# Altium schematic sheet S7CAS-PLEIADES-CARTE-MERE_P07_MOT.SchDoc
size Tabloid; DocumentNumber: 13; SheetNumber: 13; SheetTotal: 16; Sheet_Name: MOT; Size: 11x17
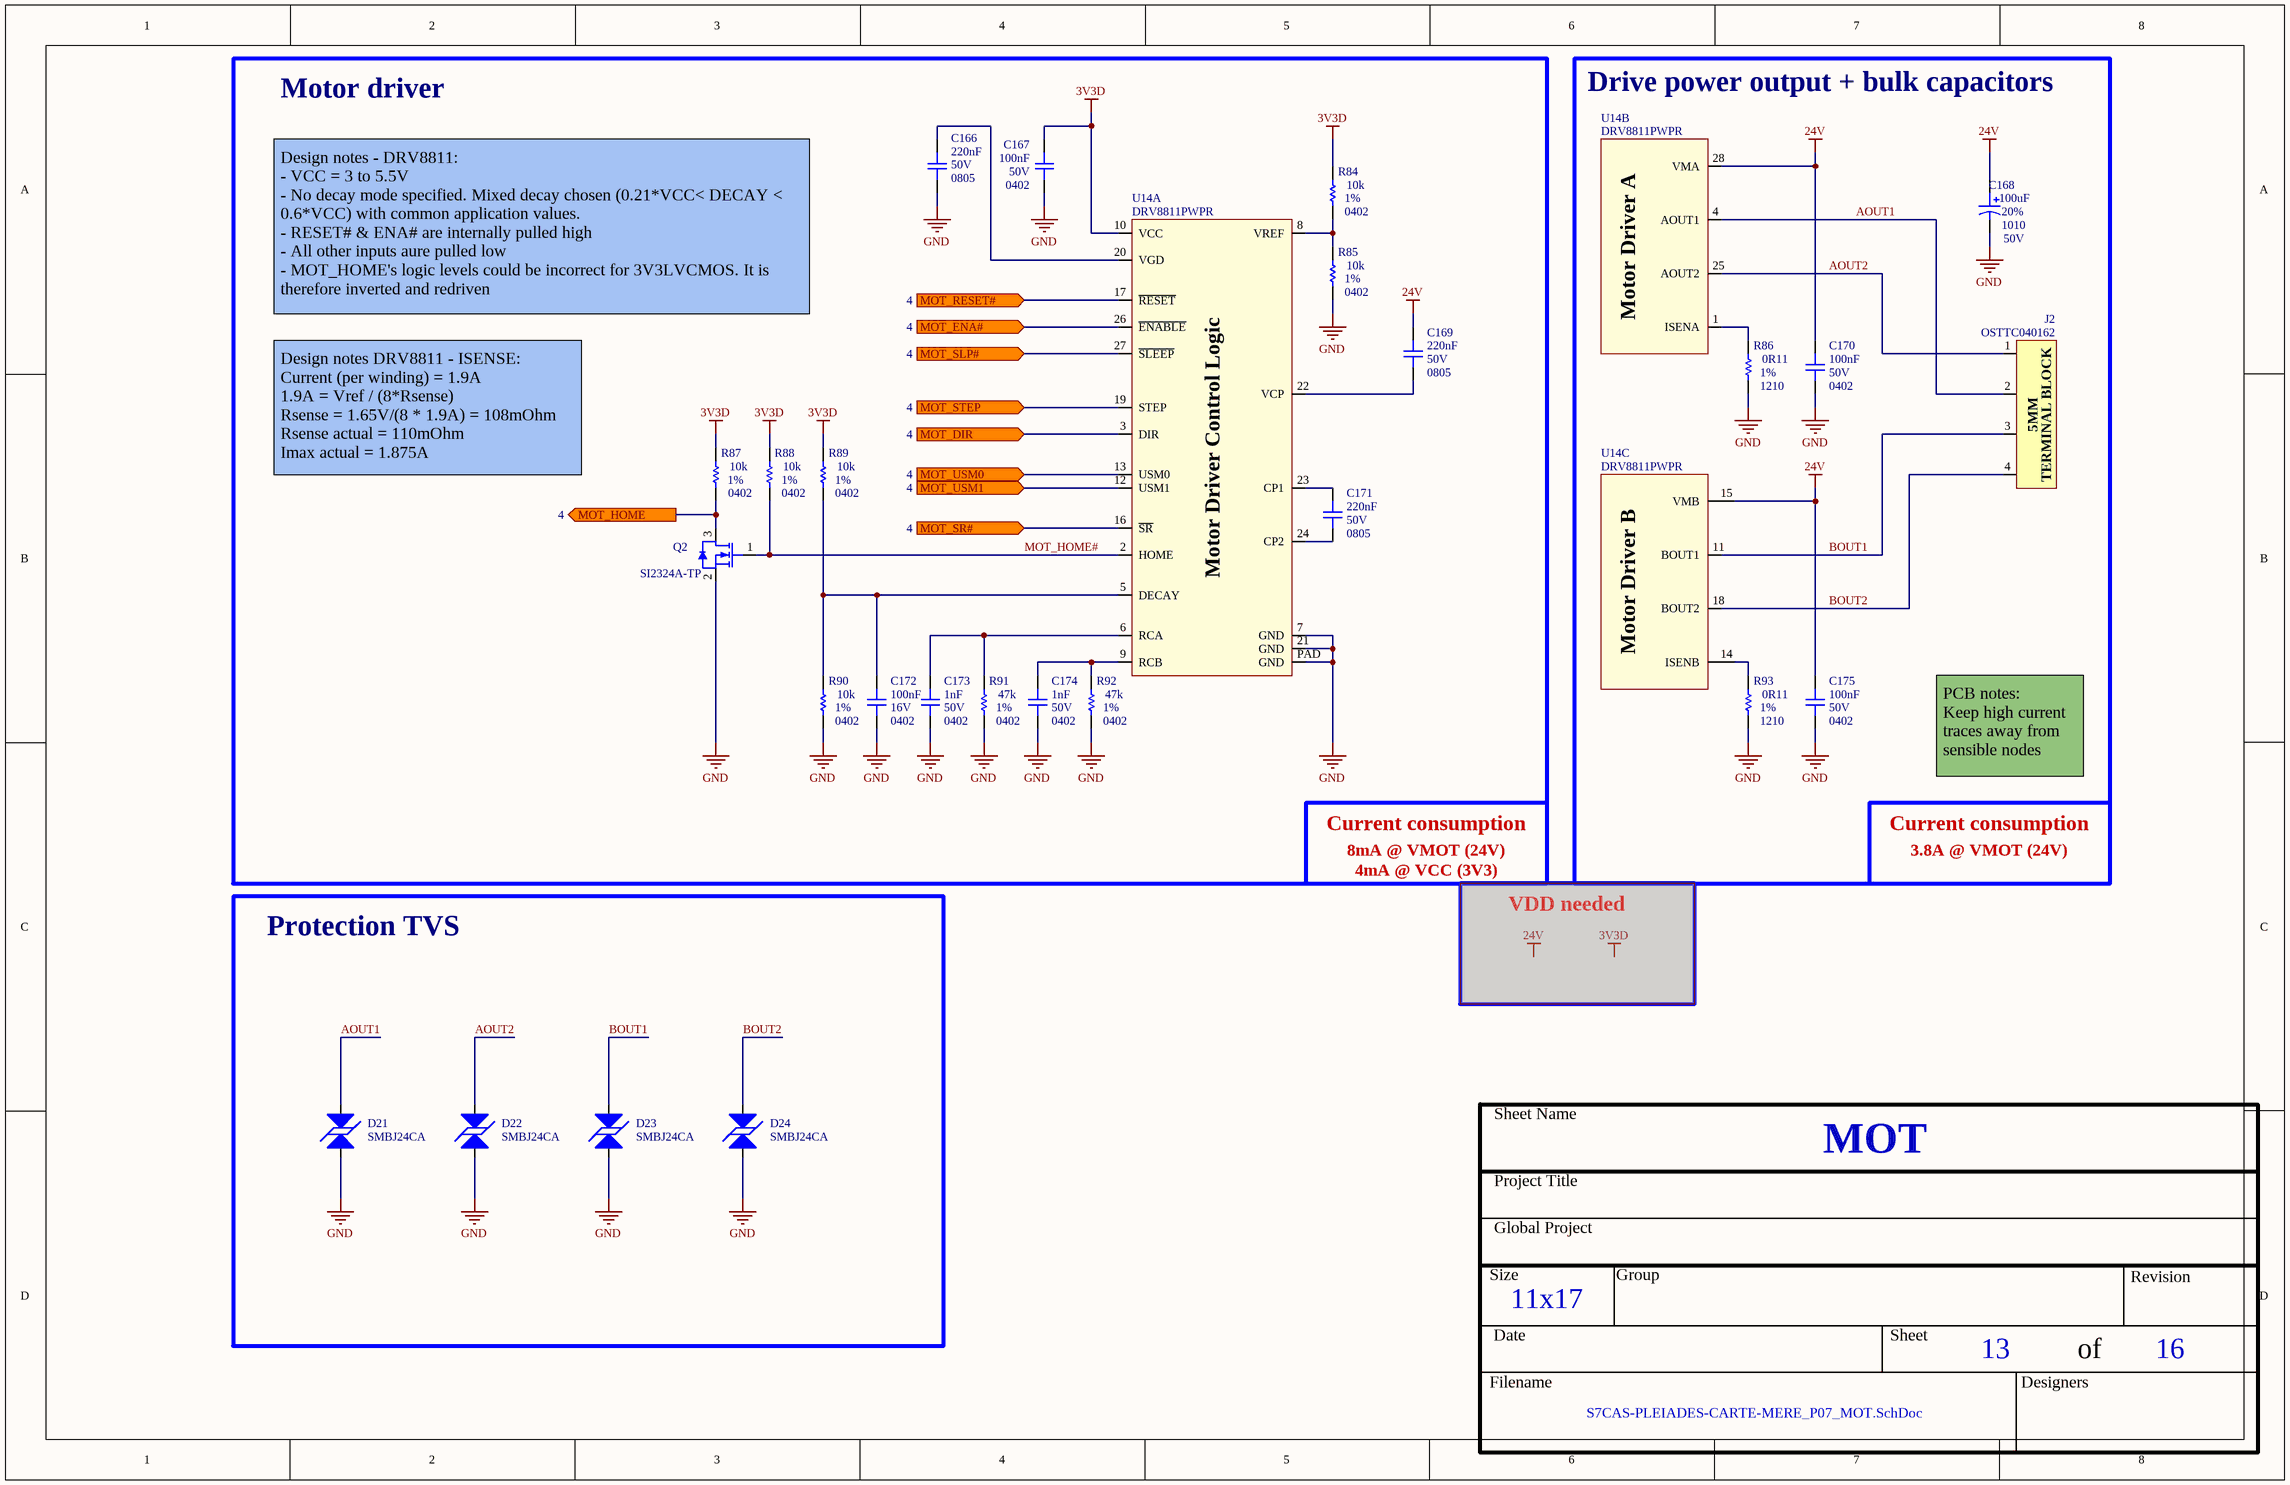
[diagram p0: S7CAS-PLEIADES-CARTE-MERE_P07_MOT.SchDoc]

## Parts
C166  value 220nF  Voltage: 50V  Package: 0805  [CAP_0805]  (hidden comment: CAP - 0805)
C167  value 100nF  Voltage: 50V  Package: 0402  [CAP_0402]  (hidden comment: CAP - 0402)
C168  value 100uF  Voltage: 50V  Package: 1010  Precision: 20%  [CAP_ALU_1010_vishay]  (hidden comment: MAL215099101E3)
C169  value 220nF  Voltage: 50V  Package: 0805  [CAP_0805]  (hidden comment: CAP - 0805)
C170  value 100nF  Voltage: 50V  Package: 0402  [CAP_0402]  (hidden comment: CAP - 0402)
C171  value 220nF  Voltage: 50V  Package: 0805  [CAP_0805]  (hidden comment: CAP - 0805)
C172  value 100nF  Voltage: 16V  Package: 0402  [CAP_0402]  (hidden comment: CAP - 0402)
C173  value 1nF  Voltage: 50V  Package: 0402  [CAP_0402]  (hidden comment: CAP - 0402)
C174  value 1nF  Voltage: 50V  Package: 0402  [CAP_0402]  (hidden comment: CAP - 0402)
C175  value 100nF  Voltage: 50V  Package: 0402  [CAP_0402]  (hidden comment: CAP - 0402)
D21  SMBJ24CA  [TVS_PWR_SMBJ36CA]
D22  SMBJ24CA  [TVS_PWR_SMBJ36CA]
D23  SMBJ24CA  [TVS_PWR_SMBJ36CA]
D24  SMBJ24CA  [TVS_PWR_SMBJ36CA]
J2  OSTTC040162  [CONN_TERMINAL_OSTTA040161]
Q2  SI2324A-TP  [TRX_NMOS_SI324A-TP]
R84  value 10k  Package: 0402  Precision: 1%  [RES_0402]  (hidden comment: RES - 0402)
R85  value 10k  Package: 0402  Precision: 1%  [RES_0402]  (hidden comment: RES - 0402)
R86  value 0R11  Package: 1210  Precision: 1%  [RES_1210]  (hidden comment: RES - 1210)
R87  value 10k  Package: 0402  Precision: 1%  [RES_0402]  (hidden comment: RES - 0402)
R88  value 10k  Package: 0402  Precision: 1%  [RES_0402]  (hidden comment: RES - 0402)
R89  value 10k  Package: 0402  Precision: 1%  [RES_0402]  (hidden comment: RES - 0402)
R90  value 10k  Package: 0402  Precision: 1%  [RES_0402]  (hidden comment: RES - 0402)
R91  value 47k  Package: 0402  Precision: 1%  [RES_0402]  (hidden comment: RES - 0402)
R92  value 47k  Package: 0402  Precision: 1%  [RES_0402]  (hidden comment: RES - 0402)
R93  value 0R11  Package: 1210  Precision: 1%  [RES_1210]  (hidden comment: RES - 1210)
U14  DRV8811PWPR  [POW_MOTOR_DRV8811PWPR]  (parts A,B,C of 3)

## Blocks framed on the sheet
Motor driver: C166 C167 C169 C171-C174 Q2 R84 R85 R87-R92 U14
Drive power output + bulk capacitors: C168 C170 C175 J2 R86 R93 U14
Protection TVS: D21-D24

## Ports
MOT_DIR (in, see 4), MOT_ENA# (in, see 4), MOT_HOME (out, see 4), MOT_RESET# (in, see 4), MOT_SLP# (in, see 4), MOT_SR# (in, see 4), MOT_STEP (in, see 4), MOT_USM0 (in, see 4), MOT_USM1 (in, see 4)

## Nets
3V3D: C167.2 R84.2 R87.2 R88.2 R89.2 U14.10(VCC)
24V: C168.1 C169.2 C170.2 C175.2 U14.15(VMB) U14.28(VMA)
GND: C166.2 C167.1 C168.2 C170.1 C172.1 C173.1 C174.1 C175.1 D21.2 D22.2 D23.2 D24.2 Q2.2(S) R85.1 R86.1 R90.1 R91.1 R92.1 R93.1 U14.7(GND) U14.21(GND) U14.PAD(GND)
AOUT1: D21.1 J2.2 U14.4(AOUT1)
AOUT2: D22.1 J2.1 U14.25(AOUT2)
BOUT1: D23.1 J2.3 U14.11(BOUT1)
BOUT2: D24.1 J2.4 U14.18(BOUT2)
MOT_DIR: U14.3(DIR) ; port MOT_DIR
MOT_ENA#: U14.26(~{ENABLE}) ; port MOT_ENA#
MOT_HOME: Q2.3(D) R87.1 ; port MOT_HOME
MOT_HOME#: Q2.1(G) R88.1 U14.2(HOME)
MOT_RESET#: U14.17(~{RESET}) ; port MOT_RESET#
MOT_SLP#: U14.27(~{SLEEP}) ; port MOT_SLP#
MOT_SR#: U14.16(~{SR}) ; port MOT_SR#
MOT_STEP: U14.19(STEP) ; port MOT_STEP
MOT_USM0: U14.13(USM0) ; port MOT_USM0
MOT_USM1: U14.12(USM1) ; port MOT_USM1
NetC166_1: C166.1 U14.20(VGD)
NetC169_1: C169.1 U14.22(VCP)
NetC171_1: C171.1 U14.24(CP2)
NetC171_2: C171.2 U14.23(CP1)
NetC172_2: C172.2 R89.1 R90.2 U14.5(DECAY)
NetC173_2: C173.2 R91.2 U14.6(RCA)
NetC174_2: C174.2 R92.2 U14.9(RCB)
NetR84_1: R84.1 R85.2 U14.8(VREF)
NetR86_2: R86.2 U14.1(ISENA)
NetR93_2: R93.2 U14.14(ISENB)

## Notes on the sheet
- Design notes - DRV8811:
  - VCC = 3 to 5.5V
  - No decay mode specified. Mixed decay chosen (0.21*VCC< DECAY < 0.6*VCC) with common application values.
  - RESET# & ENA# are internally pulled high
  - All other inputs aure pulled low
  - MOT_HOME's logic levels could be incorrect for 3V3LVCMOS. It is therefore inverted and redriven
- Design notes DRV8811 - ISENSE:
  Current (per winding) = 1.9A
  1.9A = Vref / (8*Rsense)
  Rsense = 1.65V/(8 * 1.9A) = 108mOhm
  Rsense actual = 110mOhm
  Imax actual = 1.875A
- Current consumption
- PCB notes:
  Keep high current traces away from sensible nodes
- 8mA @ VMOT (24V)
- 4mA @ VCC (3V3)
- VDD needed
- 3.8A @ VMOT (24V)
- Sheet Name
- Project Title
- Global Project
- Size
- Group
- Revision
- Date
- Sheet
- of
- Filename
- Designers
- (in symbol CONN_TERMINAL_OSTTC040162) 5MM; TERMINAL BLOCK
- (in symbol POW_MOTOR_DRV8811PWPR, part A) Motor Driver Control Logic
- (in symbol POW_MOTOR_DRV8811PWPR, part B) Motor Driver A
- (in symbol POW_MOTOR_DRV8811PWPR, part C) Motor Driver B

## Library data of the parts
C166 C169 C171 = CAP - 0805: Mfg Part Number: CL21B224KBFNNNE; Precision: 10%; Current: *; CreatedBy: Jonathan Bouchard; Power: *
C167 = CAP - 0402: Precision: 10%; Current: *; CreatedBy: Jonathan Bouchard; Power: *
C168 = CAP_ALU_MAL215099101E3: CAP - ALU 100uF 20% 50V - 1010; Current: 490mA; Mfg: Vishay Dale; Mfg Part Number: MAL215099101E3; HelpURL: http://www.vishay.com/docs/28395/150crz.pdf; CreatedBy: Jonathan Bouchard; Temperature: -55°C to 125°C; Power: *; Supplier 1: Digikey; Supplier Part Number 1: 4399PHDKR-ND
C170 C173-C175 = CAP - 0402: Mfg: C1005X7R1H102K050BA; Precision: 10%; Current: *; CreatedBy: Jonathan Bouchard; Power: *
C172 = CAP - 0402: Mfg Part Number: CL05B104KO5NNNC; Precision: 10%; Current: *; CreatedBy: Jonathan Bouchard; Power: *
D21-D24 = TVS_PWR_SMBJ24CA: TVS - 24V 26.7V 600W - DO214AA; Manufacturer #1: Littelfuse Inc.; Value: Vbr = 26.7V -  Clamp = 38.9V; Voltage Rating: 24V Standoff; Current Rating: 15.5A; GRAMS Lib Spec: 2.8; Magnetic Material: UNKNOWN; Polarized: NO; Tolerance: *; Power Max: 600W; HelpURL: http://www.littelfuse.com/~/media/electronics/datasheets/tvs_diodes/littelfuse_tvs_diode_smbj_datasheet.pdf.pdf; CreatedBy/Date: Arnaud Samson - 06/07/18; VerifiedBy: Jonathan Bouchard - 2018-07-13; Temperature: -65°C ~ 150°C (TJ); Package: DO214AA; Manufacturer #2: *; Note: *; Assembly Type: SMD; Part Number #2: *; Part Number #1: SMBJ24CA; Supplier 1: Digi-Key; Supplier Part Number 1: SMBJ24CALFCT-ND; Cryo: UNKNOWN
J2 = CONN_TERMINAL_OSTTC040162: CONN -  TERMINAL BLOCK 4POS 5MM - TH; Mfg: On Shore Technology Inc.; Voltage: *; Current: *; Power: *; Mfg Part Number: OSTTC040162; HelpURL: http://www.on-shore.com/wp-content/uploads/2015/09/osttcxx0162.pdf; CreatedBy: Jonathan Bouchard; Temperature: -30°C ~ 105°C; Value: *; Precision: *; Package: TH-4; Supplier 1: Digikey; Supplier Part Number 1: ED2602-ND
Q2 = TRX_NMOS_SI2324A-TP: TRX - MOSFET N-CH 100V 2A - SOT-23; Manufacturer #1: Micro Commercial Co; Power Max: 350mW; Voltage rating: 100V (Vds max), 2V (Vgs @ 250uA); Polarized: Yes; Magnetic Material: UNKNOWN; Current Rating: 2A; Manufacturer #2: *; Value: *; Part Number #1: SI2324A-TP; Part Number #2: *; HelpURL: https://www.mccsemi.com/pdf/Products/SI2324A(SOT-23)-A.pdf; Supplier 1: Digi-Key; Supplier Part Number 1: SI2324A-TPMSCT-ND; Assembly Type: SMD; Temperature: -55°C ~ 150°C (TJ); Package: SOT-23; CreatedBy/Date: *; GRAMS Lib Spec: *; Tolerance: *; VerifiedBy: *; Cryo: *
R84 R85 R87-R92 = RES - 0402: Voltage: 50V; Power: 1/16W; Current: *; CreatedBy: Jonathan Bouchard
R86 R93 = RES - 1210: Power: 1/16W; Current: *; CreatedBy: Jonathan Bouchard
U14 = POW_MOTOR_DRV8811PWPR: POW - STEPPER MOTOR DRIVER - SOP-28; Voltage: 3 V ~ 5.5 V / 8 V ~ 38 V; Mfg: Texas Instrument; Current: *; Power: *; Mfg Part Number: DRV8811PWPR; HelpURL: http://www.ti.com/lit/ds/symlink/drv8811.pdf; CreatedBy: Jonathan Bouchard; Temperature: -40°C ~ 150°C (TJ); Value: *; Precision: *; Package: SOP-28; Supplier 1: Digikey; Supplier Part Number 1: 296-24591-1-ND